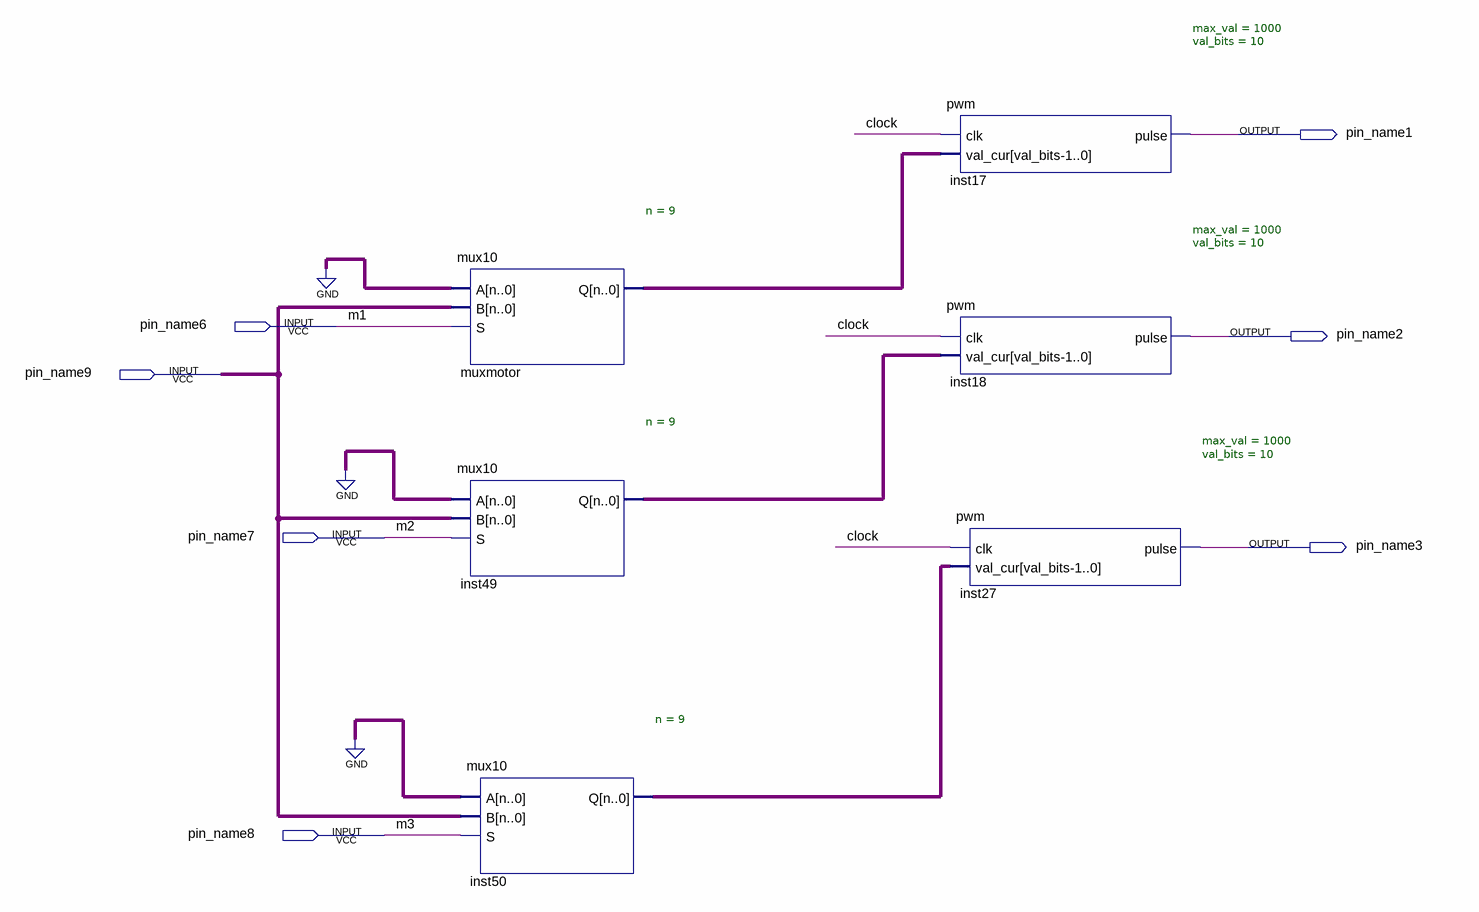
[diagram p0: schematic sheet]
// Quartus schematic Motores bloques.bdf as structural Verilog: 6 symbols, 7 pins
module \Motores_bloques  (
  input  pin_name6,
  input  pin_name9,
  input  pin_name7,
  input  pin_name8,
  output pin_name1,
  output pin_name2,
  output pin_name3
);

  wire clock;
  wire [9:0] inst49_q, inst50_q, muxmotor_q, undriven;

  mux10 #(.n(9)) muxmotor (.A({10{1'b0}}), .B(undriven), .S(pin_name6), .Q(muxmotor_q));
  mux10 #(.n(9)) inst49 (.A({10{1'b0}}), .B(undriven), .S(pin_name7), .Q(inst49_q));
  mux10 #(.n(9)) inst50 (.A({10{1'b0}}), .B(undriven), .S(pin_name8), .Q(inst50_q));
  pwm #(.max_val(1000), .val_bits(10)) inst17 (.clk(clock), .val_cur(muxmotor_q), .pulse(pin_name1));
  pwm #(.max_val(1000), .val_bits(10)) inst18 (.clk(clock), .val_cur(inst49_q), .pulse(pin_name2));
  pwm #(.max_val(1000), .val_bits(10)) inst27 (.clk(clock), .val_cur(inst50_q), .pulse(pin_name3));

  // Other names for the same wires on the sheet: m1 = pin_name6; m2 = pin_name7; m3 = pin_name8
endmodule
